# EasyEDA Pro project ProPrj_USBuddy_2026-05-01.epro

# Schematic Schematic1
Board Name: Board1; Create Date: 2026-04-30; Page Name: P1; Project Name: USBuddy; Schematic Name: Schematic1; Update Date: 2026-04-30; Company: EasyEDA.com; Page Size: A4; Version: V1.0
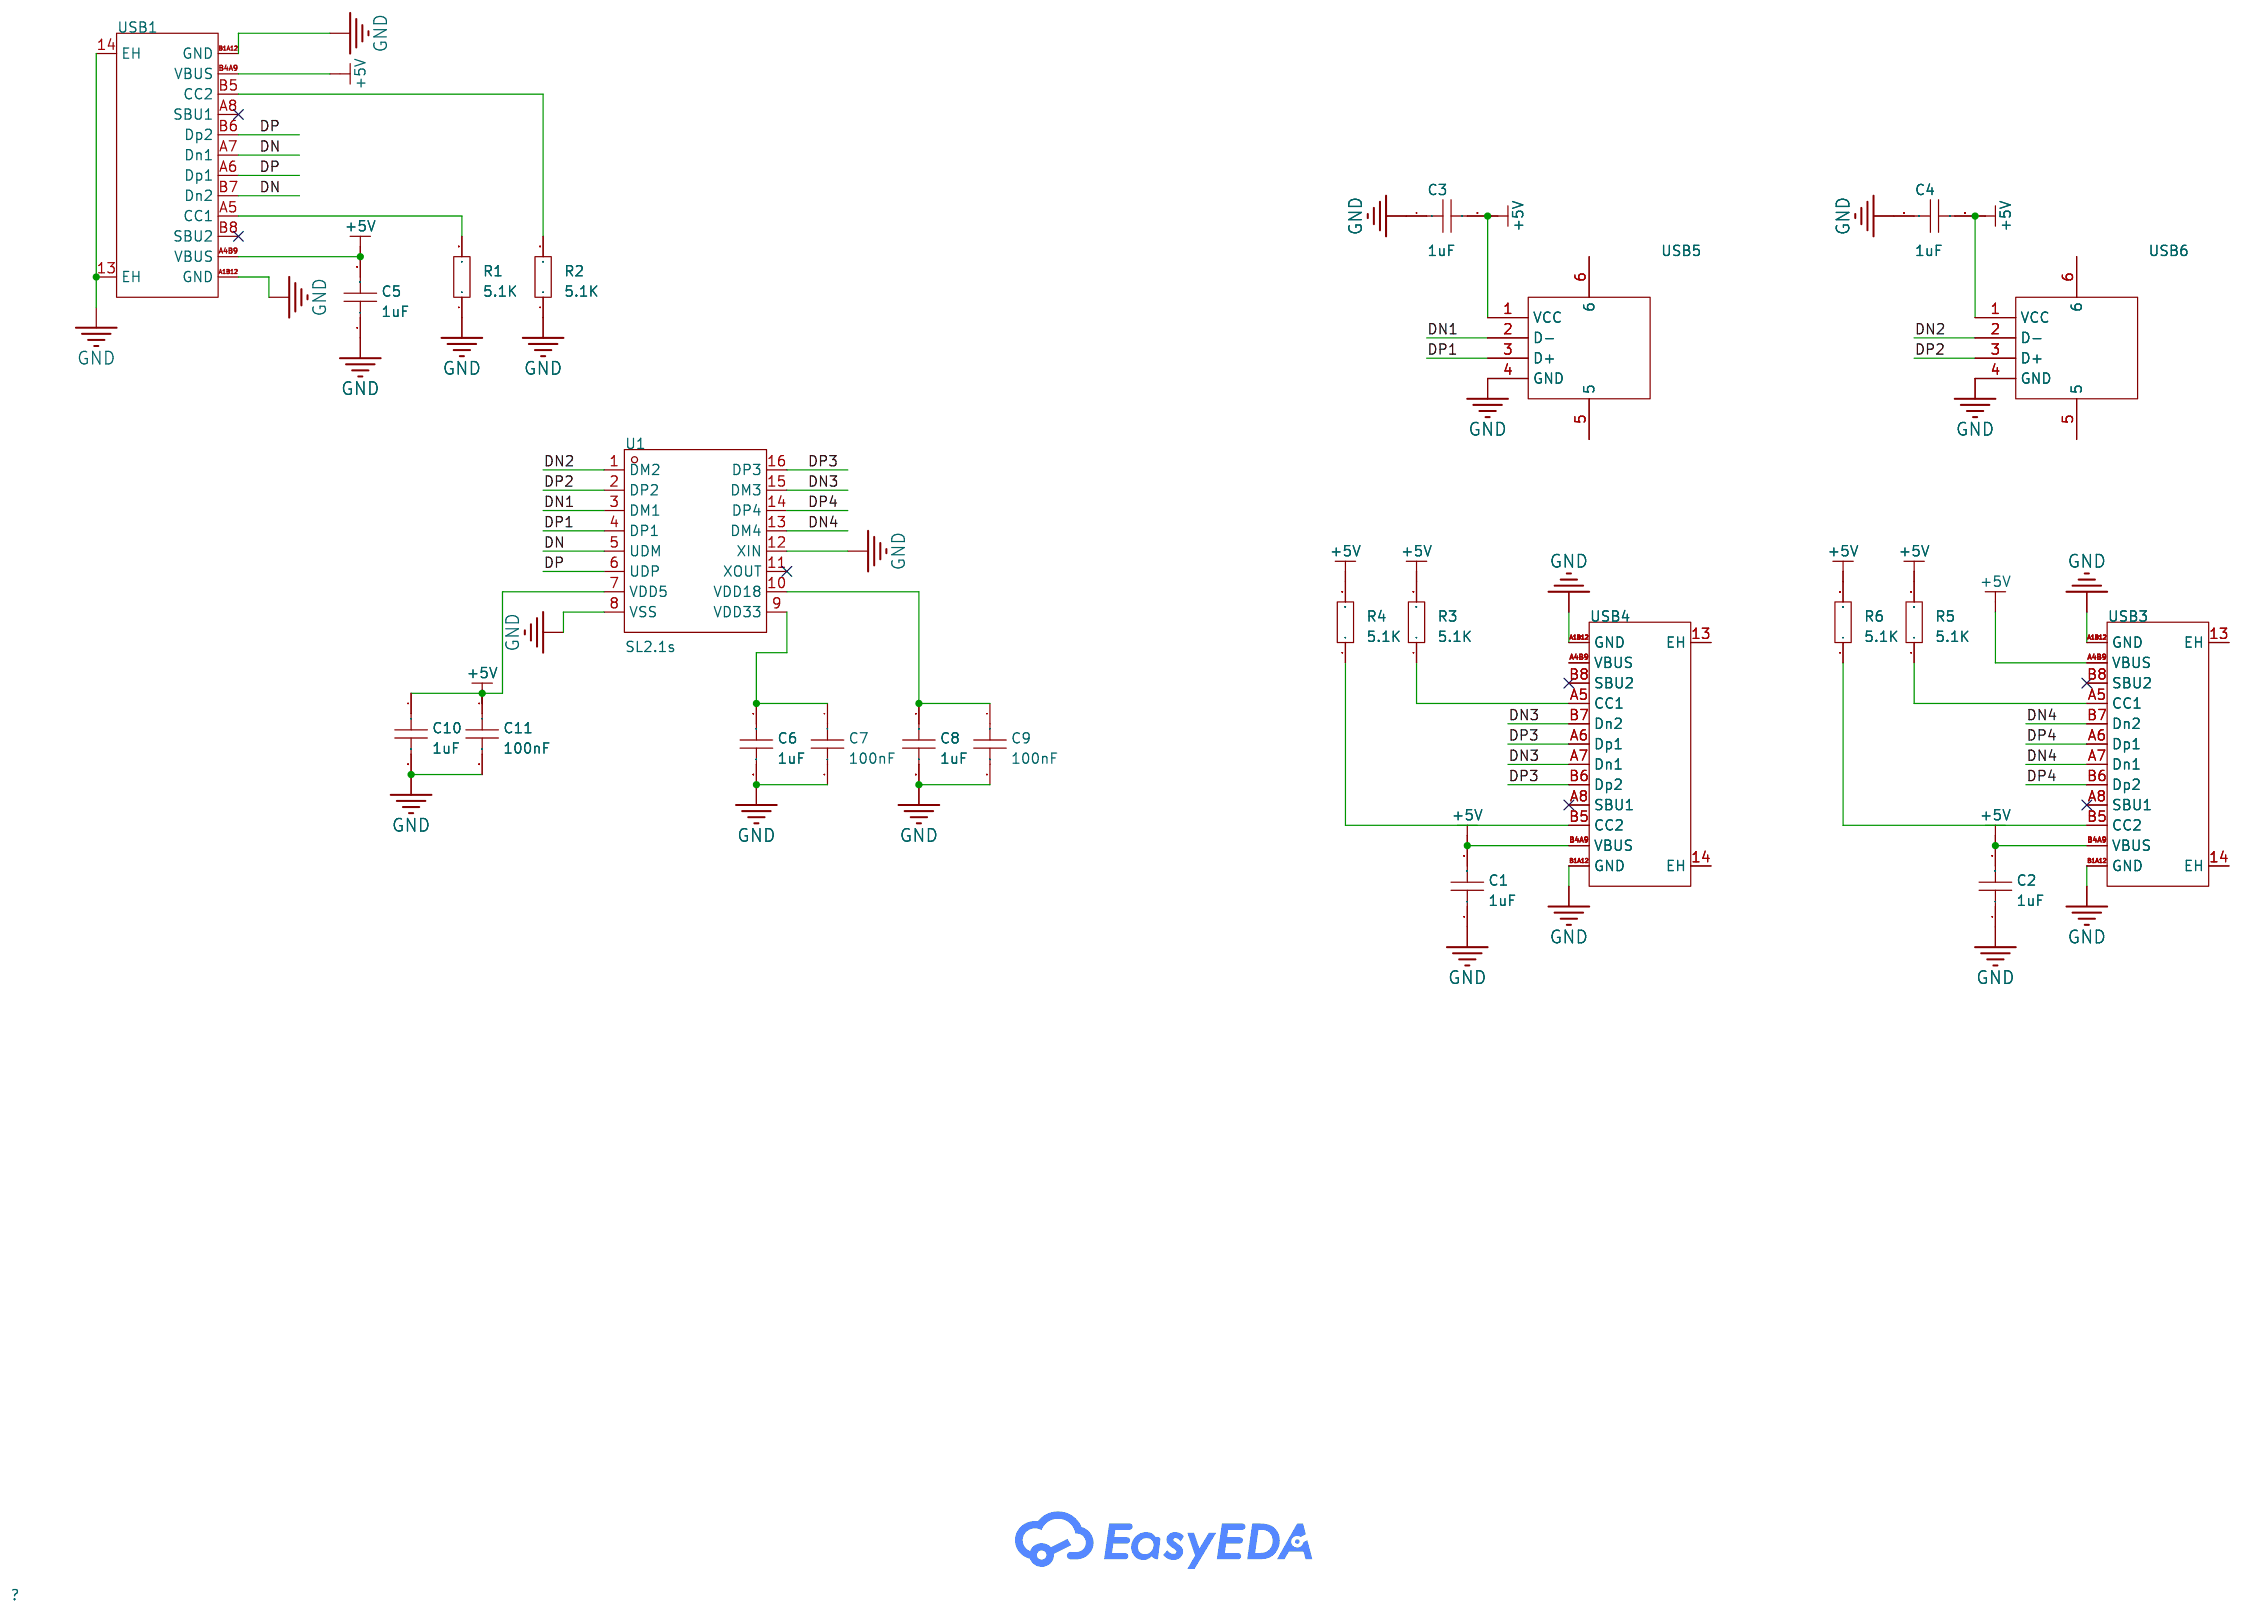
[diagram p0: schematic sheet]

## Parts
C1  1uF  [C0603]
C2  1uF  [C0603]
C3  1uF  [C0603]
C4  1uF  [C0603]
C5  1uF  [C0603]
C6  1uF  [C0603]
C7  100nF  [C0603]
C8  1uF  [C0603]
C9  100nF  [C0603]
C10  1uF  [C0603]
C11  100nF  [C0603]
R1  5.1K  [R0603]
R2  5.1K  [R0603]
R3  5.1K  [R0603]
R4  5.1K  [R0603]
R5  5.1K  [R0603]
R6  5.1K  [R0603]
U1  SL2.1s  [SSOP-16_L4.6-W2.6-P0.53-LS4.0-BL]
USB1  TYPE-C 16PIN 2MD(073)  [USB-C-SMD_TYPE-C-16PIN-2MD-073]
USB3  TYPE-C 16PIN 2MD(073)  [USB-C-SMD_TYPE-C-16PIN-2MD-073]
USB4  TYPE-C 16PIN 2MD(073)  [USB-C-SMD_TYPE-C-16PIN-2MD-073]
USB5  10.0 QHHTZB6.3  [USB-A-TH_10.0QHHTZB6.3]
USB6  10.0 QHHTZB6.3  [USB-A-TH_10.0QHHTZB6.3]

## Library data of the parts
C1-C11 = CAP_0603: Supplier Footprint: 0603
R1-R6 = Res_0603: Supplier Footprint: 0603
U1 = SL2.1s: type:Hub USB Protocol:USB 2.0 Data Rate:- Voltage - Supply:4V~5.25V Voltage - Supply:4V~5.25V Operating Temperature:0℃~+70℃ Operating Temperature:0℃~+70℃ Memory Interface:- Current - Supply:120mA Quiescent Supply Current:2.5mA Number of Channels:4; LCSC Part Name: USB2.0 HUB控制器集成电路; Supplier Part: C2684433; Manufacturer: CoreChips(和芯润德); Supplier Footprint: SSOP-16; JLCPCB Part Class: Extended Part; Datasheet: https://item.szlcsc.com/datasheet/SL2.1s/2782346.html; Supplier: LCSC; type: Hub; USB Protocol: USB 2.0; Voltage - Supply: 4V~5.25V; Operating Temperature: 0℃~+70℃; Current - Supply: 120mA; Quiescent Supply Current: 2.5mA; Number of Channels: 4
USB1 USB3 USB4 = TYPE-C 16PIN 2MD(073): Connector Type:Type-C Protocol Standard:- Gender:Female Mounting Type:Surface Mount, Right Angle Number of Contacts:16P Number of Ports:1 Current Rating-Power:3A Voltage Rating:5V Connect-Disconnect Life:10,000 Cycles Supplementary Features:- Center Heigh; LCSC Part Name: Type-C 母 卧贴; Supplier Part: C2765186; Manufacturer: SHOU HAN(首韩); Supplier Footprint: SMD; JLCPCB Part Class: Extended Part; Datasheet: https://item.szlcsc.com/datasheet/TYPE-C%252016PIN%25202MD(073)/2901843.html; Supplier: LCSC; Connector Type: Type-C; Gender: Female; Mounting Type: Surface Mount, Right Angle; Number of Contacts: 16P; Number of Ports: 1; Current Rating-Power: 3A; Voltage Rating: 5V; Connect-Disconnect Life: 10,000 Cycles; Detection color: Black; Operating Temperature: -25℃~+85℃
USB5 USB6 = 10.0 QHHTZB6.3: Connector Type:Type-A Protocol Standard:USB 2.0 Gender:Female Mounting Type:Surface Mount, Right Angle Number of Contacts:4P Number of Ports:1 Current Rating-Power:1.5A Voltage Rating:30V Connect-Disconnect Life:5,000 times Supplementary Features:- Center; LCSC Part Name: 壳长10.0mm; Supplier Part: C668591; Manufacturer: SHOU HAN(首韩); Supplier Footprint: SMD; JLCPCB Part Class: Extended Part; Datasheet: https://item.szlcsc.com/datasheet/10.0%2520QHHTZB6.3/698534.html; Supplier: LCSC; Connector Type: Type-A; Protocol Standard: USB 2.0; Gender: Female; Mounting Type: Surface Mount, Right Angle; Number of Contacts: 4P; Number of Ports: 1; Current Rating-Power: 1.5A; Voltage Rating: 30V; Connect-Disconnect Life: 5,000 times; Length: 10mm; Detection color: Black; Operating Temperature: -25℃~+85℃

## Nets
+5V: C1.2 C2.2 C3.2 C4.2 C5.2 C10.1 C11.1 R3.2 R4.2 R5.2 R6.2 U1.7(VDD5) USB1.A4B9(VBUS) USB1.B4A9(VBUS) USB3.A4B9(VBUS) USB3.B4A9(VBUS) USB4.B4A9(VBUS) USB5.1(VCC) USB6.1(VCC)
GND: C1.1 C2.1 C3.1 C4.1 C5.1 C6.2 C7.2 C8.2 C9.2 C10.2 C11.2 R1.1 R2.1 U1.8(VSS) U1.12(XIN) USB1.13(EH) USB1.14(EH) USB1.A1B12(GND) USB1.B1A12(GND) USB3.A1B12(GND) USB3.B1A12(GND) USB4.A1B12(GND) USB4.B1A12(GND) USB5.4(GND) USB6.4(GND)
DN: U1.5(UDM) USB1.A7(Dn1) USB1.B7(Dn2)
DN1: U1.3(DM1) USB5.2(D-)
DN2: U1.1(DM2) USB6.2(D-)
DN3: U1.15(DM3) USB4.A7(Dn1) USB4.B7(Dn2)
DN4: U1.13(DM4) USB3.A7(Dn1) USB3.B7(Dn2)
DP: U1.6(UDP) USB1.A6(Dp1) USB1.B6(Dp2)
DP1: U1.4(DP1) USB5.3(D+)
DP2: U1.2(DP2) USB6.3(D+)
DP3: U1.16(DP3) USB4.A6(Dp1) USB4.B6(Dp2)
DP4: U1.14(DP4) USB3.A6(Dp1) USB3.B6(Dp2)
$1N1153: R1.2 USB1.A5(CC1)
$1N1158: R2.2 USB1.B5(CC2)
$1N1832: R3.1 USB4.A5(CC1)
$1N1837: R4.1 USB4.B5(CC2)
$1N1923: R6.1 USB3.B5(CC2)
$1N1928: R5.1 USB3.A5(CC1)
$1N2451: C6.1 C7.1 U1.9(VDD33)
$1N2540: C8.1 C9.1 U1.10(VDD18)

Not connected (* = marked no-connect by the designer): U1 11(XOUT)*; USB1 A8(SBU1)* B8(SBU2)*; USB3 13(EH) 14(EH) A8(SBU1)* B8(SBU2)*; USB4 13(EH) 14(EH) A4B9(VBUS) A8(SBU1)* B8(SBU2)*; USB5 5 6; USB6 5 6

# Board PCB1
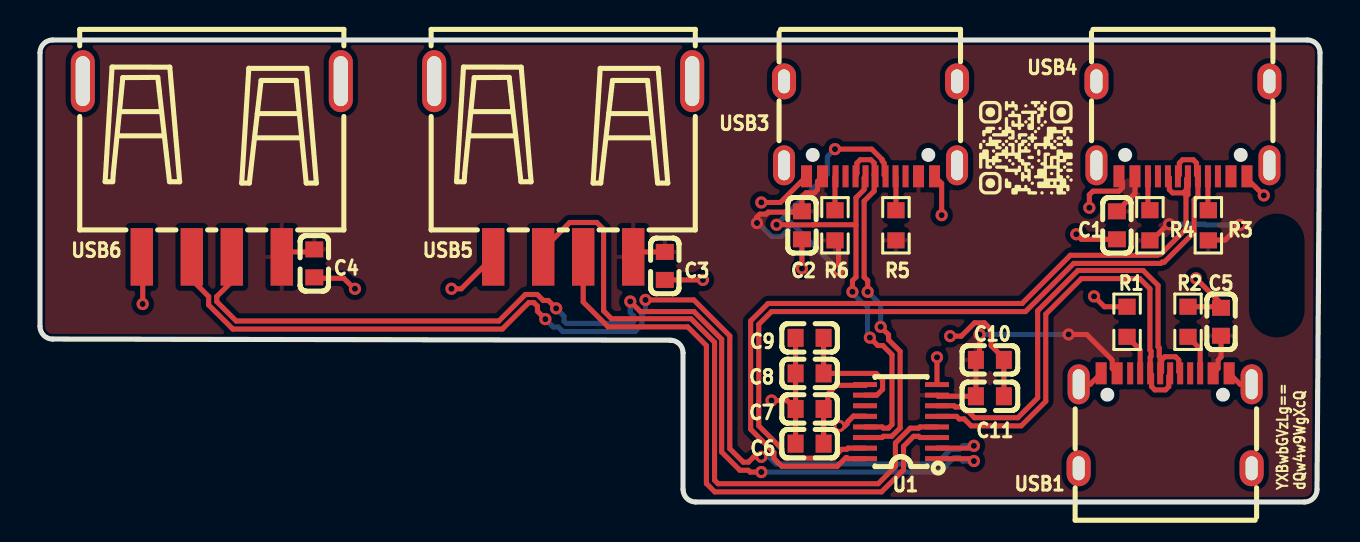
[diagram p1: board, top side]
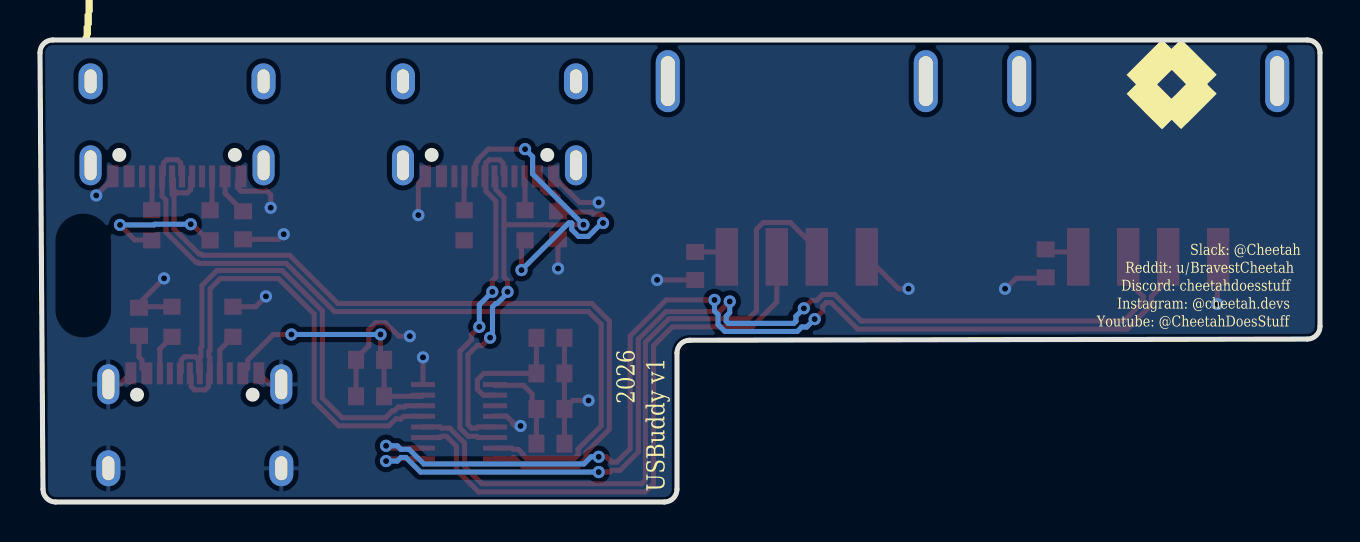
[diagram p2: board, bottom side, seen from below]

Outline 64 x 23.11 mm; copper layers: Top Layer, Bottom Layer. Coordinates in mm from the lower left corner of the outline.
Outline path: 0,22.48 0,8.79 arc(0.19,8.34) 0.63,8.15 31.52,8.09 arc(31.97,7.91) 32.15,7.46 32.15,0.64 arc(32.34,0.19) 32.79,0 63.22,0 arc(63.67,0.18) 63.86,0.63 64,22.47 arc(63.82,22.93) 63.37,23.11 0.64,23.11 arc(0.19,22.93) 0,22.48
Stack: Top Layer 0.035mm / Dielectric1 1.51mm FR4 er 4.5 / Bottom Layer 0.035mm

## Design rules (mm)
net DN2: DP3
net DP2: DP3
net DN1: DP2
net DP1: DP2
net DN: DP1
net DP: DP1
net DN4: DP5
net DP4: DP5
net DN3: DP4
net DP3: DP4
template: JLCPCB Capability(Two Layers Board)
spacing copperThickness1oz (default): track to track 0.102, other pairs 0.152 to 0.3
spacing copperThickness2oz: track to track 0.203, other pairs 0.152 to 0.3
track width copperThickness1oz (default): min 0.127, default 0.254, max 2.54
track width copperThickness2oz: min 0.203, default 0.254, max 2.54
differential pair differentialPair (default): width min 0.127, default 0.254, max 2.54; gap min 0.152, default 0.152
via viaSize (default): diameter min 0.5, default 0.61, max 10; hole min 0.3, default 0.305, max 6.3

## Placement (name value [footprint] x y rotation side)
C1  1uF  [C0603]  53.85 13.84 90 top
C2  1uF  [C0603]  38.1 13.84 90 top
C3  1uF  [C0603]  31.24 11.81 90 top
C4  1uF  [C0603]  13.72 11.94 90 top
C5  1uF  [C0603]  59.05 9.02 270 top
C6  1uF  [C0603]  38.48 2.92 180 top
C7  100nF  [C0603]  38.48 4.66 180 top
C8  1uF  [C0603]  38.48 6.43 180 top
C9  100nF  [C0603]  38.48 8.21 180 top
C10  1uF  [C0603]  47.5 7.11 0 top
C11  100nF  [C0603]  47.5 5.29 0 top
R1  5.1K  [R0603]  54.36 9.02 270 top
R2  5.1K  [R0603]  57.4 9.02 270 top
R3  5.1K  [R0603]  58.42 13.84 270 top
R4  5.1K  [R0603]  55.5 13.84 270 top
R5  5.1K  [R0603]  42.8 13.84 270 top
R6  5.1K  [R0603]  39.75 13.84 270 top
U1  SL2.1s  [SSOP-16_L4.6-W2.6-P0.53-LS4.0-BL]  43.05 4.02 90 top
USB1  TYPE-C 16PIN 2MD(073)  [USB-C-SMD_TYPE-C-16PIN-2MD-073]  56.26 4.06 0 top
USB3  TYPE-C 16PIN 2MD(073)  [USB-C-SMD_TYPE-C-16PIN-2MD-073]  41.53 18.67 180 top
USB4  TYPE-C 16PIN 2MD(073)  [USB-C-SMD_TYPE-C-16PIN-2MD-073]  57.15 18.67 180 top
USB5  10.0 QHHTZB6.3  [USB-A-TH_10.0QHHTZB6.3]  26.16 16.66 180 top
USB6  10.0 QHHTZB6.3  [USB-A-TH_10.0QHHTZB6.3]  8.59 16.66 180 top

## Footprints (pads in the part's own frame, mm; a bottom-side part is the same pattern mirrored in y, then rotated)
C0603
  rect 0.8x0.9 smd: 1(-0.7,0) 2(0.7,0)
R0603
  rect 0.806x0.864 smd: 1(-0.753,0) 2(0.753,0)
SSOP-16_L4.6-W2.6-P0.53-LS4.0-BL
  rect 0.25x1.2 smd: 1(-1.855,-1.8) 2(-1.325,-1.8) 3(-0.795,-1.8) 4(-0.265,-1.8) 5(0.265,-1.8) 6(0.795,-1.8) 7(1.325,-1.8) 8(1.855,-1.8) 9(1.855,1.8) 10(1.325,1.8) 11(0.795,1.8) 12(0.265,1.8) 13(-0.265,1.8) 14(-0.795,1.8) 15(-1.325,1.8) 16(-1.855,1.8)
USB-A-TH_10.0QHHTZB6.3
  rect 1.12x2.88 smd: 1(-3.5,4.395) 2(-1,4.395) 3(1,4.395) 4(3.5,4.395)
  oval 1.2x3.1 hole 0.7x2.5: 5(-6.45,-4.395) 6(6.45,-4.395)
USB-C-SMD_TYPE-C-16PIN-2MD-073
  oval 1.1x2 hole 0.6x1.5: 13(-4.325,1.825) 14(4.325,1.825)
  oval 1.2x1.8 hole 0.6x1.2: 13(-4.325,-2.375) 14(4.325,-2.375)
  rect 0.55x1.1 smd: A1B12(-3.2,2.375) A4B9(-2.4,2.375) B1A12(3.2,2.375) B4A9(2.4,2.375)
  rect 0.3x1.1 smd: A5(-1.25,2.375) A6(-0.25,2.375) A7(0.25,2.375) A8(1.25,2.375) B5(1.75,2.375) B6(0.75,2.375) B7(-0.75,2.375) B8(-1.75,2.375)

## Nets
As in the schematic.

Pads without a net: U1 11; USB1 A8 B8; USB3 13 14 A8 B8; USB4 13 14 A4B9 A8 B8; USB5 5 6; USB6 5 6

## Via types
v1: diameter 0.61, hole 0.305, Top Layer to Bottom Layer, 36 vias

## Routing (per net, layer and track width the routed paths; a pad name or vN(x,y) marks a point on that pad's centre or on a via; arc(x,y) is an arc through that point)
+5V: length 39.7
  Top Layer w0.254: C2.2 38.1,15.27 38.3,15.47 38.72,15.47 38.88,15.63 38.88,16.05 USB3.B4A9 ; 39.75,13.01 39.93,12.83 v1(39.93,11.6) ; v1(60,13.86) 60,13.85 59.26,13.11 58.46,13.11 ; U1.7 44.91,5.29 C11.1 C10.1 46.98,7.29 v1(46.98,8.38) ; USB1.B4A9 58.91,6.69 58.91,7.1 59.05,7.25 C5.2 ; v1(51.44,8.38) 52.34,8.38 53.61,7.1 53.61,6.69 USB1.A4B9 ; 13.71,12.56 13.66,12.51 12.14,12.51 ; 29.66,12.26 29.91,12.51 C3.2 ; 54.75,16.29 54.75,15.45 C1.2 ; 38.14,14.5 36.41,14.5 36.31,14.4 35.99,14.4 35.84,14.25 35.84,14 35.85,13.99 v1(35.85,13.96) ; v1(56.47,13.9) 56.4,13.9 55.51,13.01
  Bottom Layer w0.254: v1(60,13.86) 58.3,13.86 58.26,13.9 v1(56.47,13.9) ; v1(46.98,8.38) v1(51.44,8.38) ; v1(35.85,13.96) 35.92,13.96 36.59,13.29 37.07,13.29 37.41,13.63 37.41,13.95 37.42,13.96 37.57,13.96 v1(39.93,11.6)
GND: length 46.7
  Top Layer w0.254: C7.2 C8.2 C9.2 ; C7.2 37.36,5.08 v1(36.58,5.08) ; C7.2 C6.2 ; C1.1 52.07,13.14 v1(51.82,13.4) ; v1(52.47,14.72) 52.47,15.37 52.65,15.55 53.95,15.55 54.13,15.73 54.13,15.98 53.95,16.16 ; USB3.B1A12 37.02,14.99 v1(36.07,14.99) ; 13.62,11.19 15.19,11.19 15.69,10.69 ; 5.14,12.77 v1(5.14,9.91) ; U1.8 v1(44.85,7.24) ; v1(52.7,10.29) 53.22,9.77 R1.1 ; 48.22,7.17 47.56,7.82 47.56,8.62 47.22,8.97 46.74,8.97 46.07,8.3 v1(45.51,8.3) ; 51.94,5.89 52.51,5.89 USB1.A1B12 ; 22.66,12.26 21.07,10.67 v1(20.57,10.67) ; USB1.B1A12 60.01,5.89 USB1.14 ; 60.29,16.25 v1(61.19,15.34) ; R2.1 59,9.77 59.02,9.75 ; v1(39.98,3.8) 40.25,3.8 40.37,3.93 40.37,4 40.68,4.3 41.29,4.3 ; v1(45.08,14.35) 45.08,15.94 USB3.A1B12 ; 59.02,9.72 59.02,9.75 ; 59.02,9.75 59.02,9.97 v1(57.8,11.19) ; 59.02,9.75 C5.1 ; C3.1 v1(33.15,11.11) ; C10.2 C11.2 ; v1(38.1,11.68) C2.1
  Bottom Layer w0.254: v1(39.98,3.8) 39.98,3.85 40,3.87 ; v1(61.19,15.34) 61.08,15.22 ; v1(52.47,14.72) 52.4,14.72
  vias: v1(15.75,10.67)
DN: length 23.3
  Top Layer w0.254: USB1.A7 56.49,6.42 56.49,6.34 56.44,6.29 56.44,5.77 56.28,5.61 55.75,5.61 55.58,5.77 55.58,6.37 USB1.B7 55.51,7.24 55.56,7.29 55.56,7.54 55.5,7.6 55.5,10.67 54.99,11.18 52.07,11.18 50.29,9.4 50.29,5.04 49.06,3.81 46.56,3.81 46.21,4.16 45.96,4.16 45.83,4.29 U1.5
DN1: length 29.8
  Top Layer w0.254: 27.16,12.26 27.16,10.01 28.41,8.76 32.39,8.76 33.32,7.83 33.32,0.93 33.74,0.51 42.08,0.51 43.18,1.61 43.18,2.78 43.68,3.29 43.94,3.29 44,3.23 U1.3
DN2: length 53
  Top Layer w0.254: v1(25.81,9.69) 25.41,10.08 25.16,10.08 24.86,10.38 24.27,10.38 22.95,9.06 9.81,9.06 8.84,10.03 8.84,10.28 9.64,11.08 9.64,12.77 ; v1(29.52,10.03) 30.02,9.53 32.7,9.53 34.09,8.14 34.09,2.5 35,1.59 35.42,1.59 35.51,1.5 v1(36.07,1.5) ; v1(46.7,2.05) 46.58,2.17 U1.1
  Bottom Layer w0.254: v1(36.07,1.5) 44.98,1.5 45.71,2.23 45.96,2.23 46.14,2.05 v1(46.7,2.05) ; v1(29.52,10.03) 29.52,9.47 29.69,9.3 29.69,9.04 29.59,8.94 26.31,8.94 26.2,9.04 26.2,9.29 v1(25.81,9.69)
DN3: length 40.4
  Top Layer w0.254: USB4.A7 56.97,16.36 56.97,16.96 57.13,17.12 57.67,17.12 57.83,16.96 57.83,16.36 USB4.B7 57.9,15.31 57.71,15.11 57.71,13.5 56.21,12 56.11,12 56.05,11.94 51.69,11.94 49.28,9.53 36.58,9.53 35.94,8.89 35.94,3.81 37.1,2.65 37.1,2.36 37.27,2.19 39.7,2.19 39.86,2.36 39.86,2.41 40.08,2.63 40.34,2.63 40.4,2.7 41.25,2.7
DN4: length 27.6
  Top Layer w0.254: v1(40.63,10.52) 40.63,11.07 40.8,11.25 40.8,13.87 ; 41.25,3.76 42.11,3.76 42.17,3.69 42.42,3.69 42.6,3.87 42.6,7.37 42.14,7.83 41.89,7.83 v1(41.5,8.22) ; USB3.A7 41.21,16.22 41.21,15.63 40.8,15.22 40.8,13.87 ; 40.8,13.87 38.67,13.87 38.67,13.86 37.53,13.86 37.53,13.87 v1(36.83,13.87) ; USB3.B7 42.21,16.36 42.21,16.96 42.11,17.05 42.11,17.13 41.59,17.65 v1(39.75,17.65)
  Bottom Layer w0.254: v1(36.83,13.87) 39.37,16.41 39.37,17.27 v1(39.75,17.65) ; v1(40.63,10.52) 40.63,10.45 41.15,9.93 41.21,9.93 41.38,9.76 41.38,8.34 v1(41.5,8.22)
DP: length 24
  Top Layer w0.254: U1.6 45.71,4.82 45.77,4.75 46.09,4.75 46.28,4.56 46.38,4.56 46.73,4.22 48.89,4.22 49.89,5.21 49.89,9.57 51.9,11.58 55.16,11.58 55.91,10.84 55.91,7.77 55.96,7.71 55.96,7.29 56.01,7.24 USB1.A6 56.08,6.51 56.08,7.1 56.25,7.27 56.78,7.27 56.94,7.1 56.94,6.51 USB1.B6
DP1: length 34.3
  Top Layer w0.254: 44.85,3.76 44,3.76 43.94,3.69 43.52,3.69 42.77,2.95 42.77,1.78 41.91,0.91 33.91,0.91 33.73,1.09 33.73,7.99 32.55,9.17 28.58,9.17 28.18,9.56 28.18,13.64 27.84,13.98 26.49,13.98 25.16,12.66 25.16,12.26
DP2: length 53.8
  Top Layer w0.254: v1(25.27,9.15) 24.87,9.55 24.87,9.8 24.69,9.98 24.44,9.98 23.11,8.65 9.64,8.65 8.43,9.86 8.43,10.28 7.64,11.08 7.64,12.77 ; 44.85,2.7 46.58,2.7 v1(46.7,2.81) ; v1(30.28,10.11) 32.69,10.11 34.49,8.31 34.49,2.67 35.17,1.99 35.42,1.99 35.69,2.26 v1(36.07,2.26)
  Bottom Layer w0.254: v1(46.7,2.81) 46.14,2.81 45.96,2.63 45.54,2.63 44.81,1.91 36.8,1.91 36.45,2.26 v1(36.07,2.26) ; v1(30.28,10.11) 30.28,9.55 30.1,9.37 30.1,8.87 29.76,8.53 26.14,8.53 25.92,8.75 25.66,8.75 v1(25.27,9.15)
DP3: length 41
  Top Layer w0.254: USB4.B6 56.47,16.22 56.47,15.63 56.63,15.47 57.17,15.47 57.33,15.63 57.33,16.15 57.38,16.2 57.38,16.27 USB4.A6 57.4,15.38 57.3,15.28 57.3,13.66 56.05,12.41 55.94,12.41 55.88,12.34 51.52,12.34 49.11,9.93 36.41,9.93 35.53,9.06 35.53,3.64 36.7,2.48 36.7,2.19 37.1,1.79 39.86,1.79 40.31,2.23 40.34,2.23 40.4,2.17 U1.16
DP4: length 17.9
  Top Layer w0.254: 41.71,16.36 41.71,16.96 41.54,17.12 41.01,17.12 40.85,16.96 40.85,16.44 40.8,16.39 40.8,16.32 USB3.B6 ; 41.71,16.36 USB3.A6 ; 41.71,16.36 41.71,15.55 41.21,15.06 41.21,11.25 41.39,11.07 v1(41.39,10.52) ; U1.14 42.11,3.23 42.17,3.29 42.59,3.29 43.01,3.71 43.01,7.54 42.43,8.11 42.43,8.37 v1(42.04,8.76)
  Bottom Layer w0.254: v1(42.04,8.76) 42.04,9.87 v1(41.39,10.52)
$1N1153: length 2.1
  Top Layer w0.254: USB1.A5 55.01,7.61 R1.2
$1N1158: length 2.1
  Top Layer w0.254: R2.2 58.01,7.66 USB1.B5
$1N1832: length 1.7
  Top Layer w0.254: R3.1 58.4,14.62 USB4.A5
$1N1837: length 1.7
  Top Layer w0.254: R4.1 55.4,14.7 USB4.B5
$1N1923: length 1.7
  Top Layer w0.254: USB3.B5 39.75,16.27 R6.1
$1N1928: length 1.7
  Top Layer w0.254: USB3.A5 42.8,16.27 R5.1
$1N2451: length 4.6
  Top Layer w0.254: 39.18,4.59 39.39,4.81 39.39,5.4 39.83,5.84 41.26,5.84 41.27,5.83 ; 39.18,4.59 C6.1
$1N2540: length 6.3
  Top Layer w0.254: U1.10 41.84,5.35 42.13,5.64 42.13,6.12 41.81,6.43 C8.1 C9.1

## Copper pours and planes (outline as drawn; the poured copper is in the pictures)
+5V on Top Layer: -1.27,25.02 65.41,25.02 65.41,-2.03 -1.27,-2.03
GND on Bottom Layer: -2.79,27.94 69.34,27.94 69.34,-3.17 -2.79,-3.17

## Text on the board
Bottom Silkscreen Layer: Slack: @Cheetah / Reddit: u/BravestCheetah / Discord: cheetahdoesstuff / Instagram: @cheetah.devs / Youtube: @CheetahDoesStuff | 2026 / USBuddy v1
Top Silkscreen Layer: YXBwbGVzLg== / dQw4w9WgXcQ
